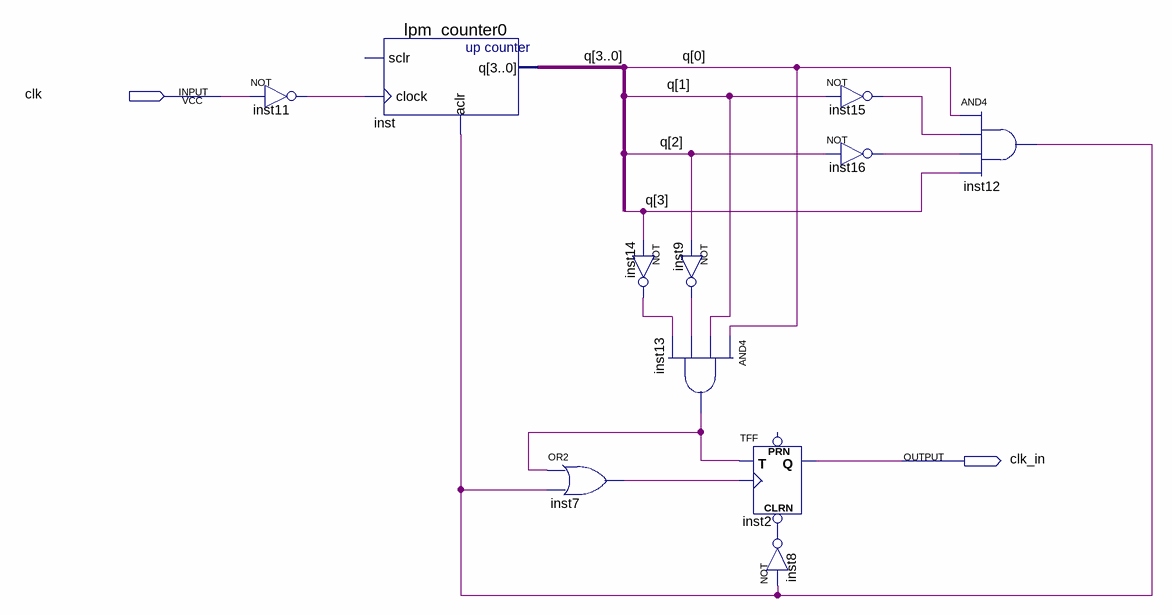
[diagram p0: schematic sheet]
// Quartus schematic lab2.bdf as structural Verilog: 11 symbols, 2 pins
module lab2 (
  input  clk,
  output clk_in
);

  wire inst7_out, inst8_out, inst9_out, inst11_out, inst12_out, inst13_out, inst14_out, inst15_out,
       inst16_out;
  wire [3:0] q;

  not inst11 (inst11_out, clk);
  lpm_counter0 inst (.clock(inst11_out), .aclr(inst12_out), .q(q));  // open: sclr
  or inst7 (inst7_out, inst13_out, inst12_out);
  not inst14 (inst14_out, q[3]);
  not inst9 (inst9_out, q[2]);
  and inst13 (inst13_out, q[0], q[1], inst9_out, inst14_out);
  TFF inst2 (.CLRN(inst8_out), .T(inst13_out), .CLK(inst7_out), .Q(clk_in));  // open: PRN
  not inst8 (inst8_out, inst12_out);
  not inst15 (inst15_out, q[1]);
  not inst16 (inst16_out, q[2]);
  and inst12 (inst12_out, q[0], inst15_out, inst16_out, q[3]);
endmodule
